# Altium schematic sheet nanopiair_audiohat.SchDoc
size A3
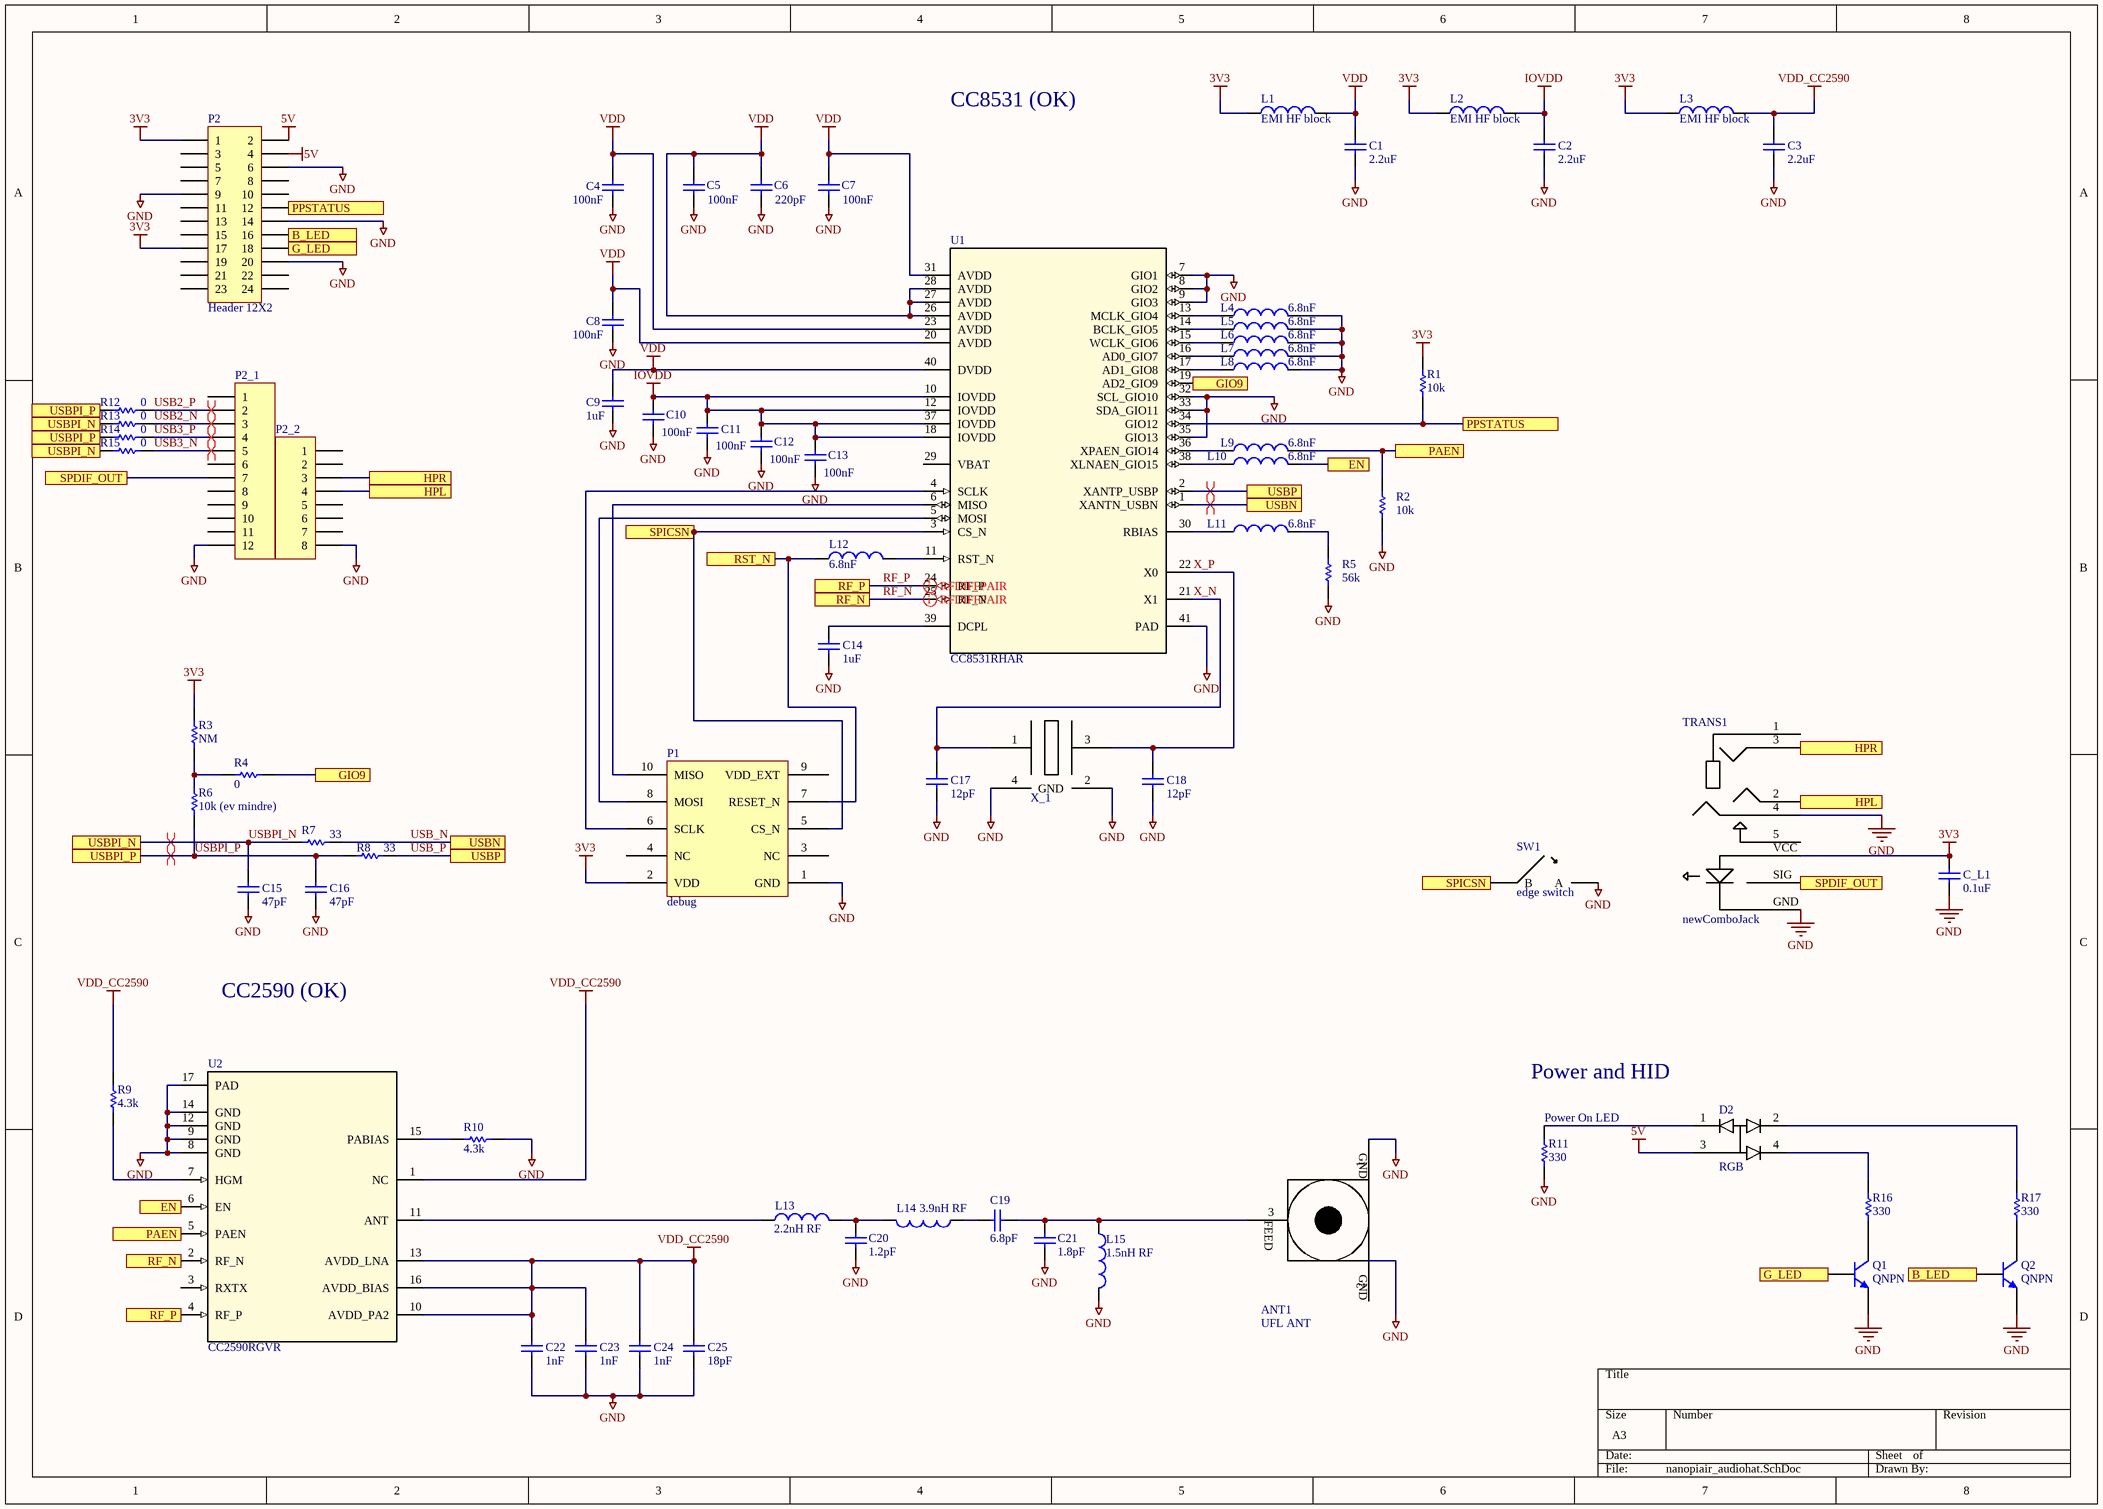
[diagram p0: nanopiair_audiohat.SchDoc]

## Parts
ANT1  UFL ANT  [UFL_ANT]
C1  value 2.2uF  [C_0402]
C2  value 2.2uF  [C_0402]
C3  value 2.2uF  [C_0402]
C4  value 100nF  [C_0402]
C5  value 100nF  [C_0402]
C6  value 220pF  [C_0402]
C7  value 100nF  [C_0402]
C8  value 100nF  [C_0402]
C9  value 1uF  [C_0402]
C10  value 100nF  [C_0402]
C11  value 100nF  [C_0402]
C12  value 100nF  [C_0402]
C13  value 100nF  [C_0402]
C14  value 1uF  [C_0402]
C15  value 47pF  [C_0402]
C16  value 47pF  [C_0402]
C17  value 12pF  [C_0402]
C18  value 12pF  [C_0402]
C19  value 6.8pF  [C_0402_RF_IN]
C20  value 1.2pF  [C_0402_RF_IN_OUT]
C21  value 1.8pF  [C_0402_RF_IN_OUT]
C22  value 1nF  [C_0402]
C23  value 1nF  [C_0402]
C24  value 1nF  [C_0402]
C25  value 18pF  [C_0402]
C_L1  value 0.1uF  [C_0402]
D2  RGB  [RGB]
L1  value EMI HF block  [L_0402]  (hidden comment: Inductor)
L2  value EMI HF block  [L_0402]  (hidden comment: Inductor)
L3  value EMI HF block  [L_0402]  (hidden comment: Inductor)
L4  value 6.8nF  [L_0402]  (hidden comment: Inductor)
L5  value 6.8nF  [L_0402]  (hidden comment: Inductor)
L6  value 6.8nF  [L_0402]  (hidden comment: Inductor)
L7  value 6.8nF  [L_0402]  (hidden comment: Inductor)
L8  value 6.8nF  [L_0402]  (hidden comment: Inductor)
L9  value 6.8nF  [L_0402]  (hidden comment: Inductor)
L10  value 6.8nF  [L_0402]  (hidden comment: Inductor)
L11  value 6.8nF  [L_0402]  (hidden comment: Inductor)
L12  value 6.8nF  [L_0402]  (hidden comment: Inductor)
L13  value 2.2nH RF  [L_0402_RF_IN]  (hidden comment: Inductor)
L14  value 3.9nH RF  [L_0402_RF_IN]  (hidden comment: Inductor)
L15  value 1.5nH RF  [L_0402_RF_IN_OUT]  (hidden comment: Inductor)
P1  debug  [2x5 1.27mm header]
P2  Header 12X2  [HDR2X12]
P2_1  (no value)  [HDR1X12]
P2_2  Header 8  [HDR1X8]  (value not drawn)
Q1  QNPN  [SOT-23B_N]
Q2  QNPN  [SOT-23B_N]
R1  value 10k  [R_0402]  (hidden comment: Res1)
R2  value 10k  [R_0402]  (hidden comment: Res1)
R3  value NM  [R_0402]  (hidden comment: Res1)
R4  value 0  [R_0402]  (hidden comment: Res1)
R5  value 56k  [R_0402]  (hidden comment: Res1)
R6  value 10k (ev mindre)  [R_0402]  (hidden comment: Res1)
R7  value 33  [R_0402]  (hidden comment: Res1)
R8  value 33  [R_0402]  (hidden comment: Res1)
R9  value 4.3k  [R_0402]  (hidden comment: Res1)
R10  value 4.3k  [R_0402]  (hidden comment: Res1)
R11  value 330  [R_0402]  (hidden comment: Res1)
R12  value 0  [R_0402]  (hidden comment: Res1)
R13  value 0  [R_0402]  (hidden comment: Res1)
R14  value 0  [R_0402]  (hidden comment: Res1)
R15  value 0  [R_0402]  (hidden comment: Res1)
R16  value 330  [R_0402]  (hidden comment: Res1)
R17  value 330  [R_0402]  (hidden comment: Res1)
SW1  edge switch  [edge swich]
TRANS1  newComboJack  [audio combojack]
U1  CC8531RHAR  [RHA0040H]
U2  CC2590RGVR  [RGV0016A]
X_1  X_48  [48Mhz 2x1.6mm SMD]  (value not drawn)

## Ports
B_LED, EN, G_LED, GIO9, HPL, HPR, PAEN, PPSTATUS, RF_N, RF_P, RST_N, SPDIF_OUT, SPICSN, USBN, USBP, USBPI_N, USBPI_P

## Nets
3V3: C_L1.2 L1.1 L2.1 L3.1 P1.2(VDD) P2.1 P2.17 R1.2 R3.2 TRANS1.VCC
5V: D2.3(ANODE) P2.2 P2.4
GND: ANT1.1(GND) ANT1.2(GND) C1.1 C2.1 C3.1 C4.1 C5.1 C6.1 C7.1 C8.1 C9.1 C10.2 C11.1 C12.1 C13.1 C14.1 C15.1 C16.1 C17.1 C18.1 C20.2 C21.2 C22.1 C23.1 C24.1 C25.1 C_L1.1 L4.2 L5.2 L6.2 L7.2 L8.2 L15.2 P1.1(GND) P2.6 P2.9 P2.14 P2.20 P2_1.12 P2_2.8 Q1.2(E) Q2.2(E) R2.1 R5.1 R10.1 R11.2 SW1.A TRANS1.4 TRANS1.GND U1.7(GIO1) U1.8(GIO2) U1.9(GIO3) U1.32(SCL_GIO10) U1.33(SDA_GIO11) U1.35(GIO13) U1.41(PAD) U2.8(GND) U2.9(GND) U2.12(GND) U2.14(GND) U2.17(PAD) X_1.2(GND) X_1.4(GND)
IOVDD: C2.2 C10.1 C11.2 C12.2 C13.2 L2.2 U1.10(IOVDD) U1.12(IOVDD) U1.18(IOVDD) U1.37(IOVDD)
VDD: C1.2 C4.2 C5.2 C6.2 C7.2 C8.2 C9.2 L1.2 U1.20(AVDD) U1.23(AVDD) U1.26(AVDD) U1.27(AVDD) U1.28(AVDD) U1.31(AVDD) U1.40(DVDD)
VDD_CC2590: C3.2 C22.2 C23.2 C24.2 C25.2 L3.2 R9.2 U2.1(NC) U2.10(AVDD_PA2) U2.13(AVDD_LNA) U2.16(AVDD_BIAS)
B_LED: P2.16 Q2.1(B) ; port B_LED
EN: L10.2 U2.6(EN) ; port EN
G_LED: P2.18 Q1.1(B) ; port G_LED
GIO9: R4.1 U1.19(AD2_GIO9) ; port GIO9
HPL: P2_2.4 TRANS1.2 ; port HPL
HPR: P2_2.3 TRANS1.3 ; port HPR
PAEN: L9.2 R2.2 U2.5(PAEN) ; port PAEN
PPSTATUS: P2.12 R1.1 U1.34(GIO12) ; port PPSTATUS
RF_N: U1.25(RF_N) U2.2(RF_N) ; port RF_N
RF_P: U1.24(RF_P) U2.4(RF_P) ; port RF_P
RST_N: L12.1 P1.7(RESET_N) ; port RST_N
SPDIF_OUT: P2_1.7 TRANS1.SIG ; port SPDIF_OUT
SPICSN: P1.5(CS_N) SW1.B U1.3(CS_N) ; port SPICSN
USB2_N: P2_1.3 R13.1
USB2_P: P2_1.2 R12.1
USB3_N: P2_1.5 R15.1
USB3_P: P2_1.4 R14.1
USB_N: R7.1 U1.1(XANTN_USBN) ; port USBN
USB_P: R8.1 U1.2(XANTP_USBP) ; port USBP
USBPI_N: C15.2 R7.2 R13.2 R15.2 ; port USBPI_N
USBPI_P: C16.2 R6.1 R8.2 R12.2 R14.2 ; port USBPI_P
X_N: C17.2 U1.21(X1) X_1.1
X_P: C18.2 U1.22(X0) X_1.3
NetANT1_3: ANT1.3(FEED) C19.1 C21.1 L15.1
NetC14_2: C14.2 U1.39(DCPL)
NetC19_2: C19.2 L14.1
NetC20_1: C20.1 L13.2 L14.2
NetD2_1: D2.1(RED) R11.1
NetD2_2: D2.2(GREEN) R17.1
NetD2_4: D2.4(BLUE) R16.1
NetL4_1: L4.1 U1.13(MCLK_GIO4)
NetL5_1: L5.1 U1.14(BCLK_GIO5)
NetL6_1: L6.1 U1.15(WCLK_GIO6)
NetL7_1: L7.1 U1.16(AD0_GIO7)
NetL8_1: L8.1 U1.17(AD1_GIO8)
NetL9_1: L9.1 U1.36(XPAEN_GIO14)
NetL10_1: L10.1 U1.38(XLNAEN_GIO15)
NetL11_1: L11.1 U1.30(RBIAS)
NetL11_2: L11.2 R5.2
NetL12_2: L12.2 U1.11(RST_N)
NetL13_1: L13.1 U2.11(ANT)
NetP1_6: P1.6(SCLK) U1.4(SCLK)
NetP1_8: P1.8(MOSI) U1.5(MOSI)
NetP1_10: P1.10(MISO) U1.6(MISO)
NetQ1_3: Q1.3(C) R16.2
NetQ2_3: Q2.3(C) R17.2
NetR3_1: R3.1 R4.2 R6.2
NetR9_1: R9.1 U2.7(HGM)
NetR10_2: R10.2 U2.15(PABIAS)

Not connected (* = marked no-connect by the designer): P1 3(NC) 4(NC) 9(VDD_EXT); P2 3 5 7 8 10 11 13 15 19 21 22 23 24; P2_1 1 6 8 9 10 11; P2_2 1 2 5 6 7; TRANS1 1 5; U1 29(VBAT); U2 3(RXTX)

## Layout directives
differential pair: RF_N, RF_P, USB2_N, USB2_P, USB3_N, USB3_P, USB_N, USB_P, USBPI_N, USBPI_P

## Notes on the sheet
- CC8531 (OK)
- CC2590 (OK)
- Power and HID
- (near R11) Power On LED

## Library data of the parts
C1-C25 C_L1 = Cap
P2 = Header 12X2: Header, 12-Pin, Dual row; LatestRevisionDate: 17-Jul-2002; LatestRevisionNote: Re-released for DXP Platform.; Publisher: Altium Limited
P2_1 = Header 12: Header, 12-Pin; LatestRevisionDate: 17-Jul-2002; LatestRevisionNote: Re-released for DXP Platform.; Publisher: Altium Limited
P2_2 = Header 8: Header, 8-Pin; LatestRevisionDate: 17-Jul-2002; LatestRevisionNote: Re-released for DXP Platform.; Publisher: Altium Limited
Q1 Q2 = QNPN: NPN Bipolar Transistor; Published: 8-Jun-2000; LatestRevisionDate: 29-May-2009; LatestRevisionNote: IPC-7351 Footprint Added.; PackageVersion: Aug-1999; PackageReference: SOT-23B; Publisher: Altium Limited; PackageDescription: 3-Pin SOT-23 Package 0.95 mm Pitch, 2.4 mm Lead Span
R1-R17 = Res1: Resistor
U1 = CC8531RHAR: Imported; Manufacturer: Texas Instruments; PartNumber: CC8531RHAR; RefDes: RefDes; TYPE: TYPE; Value: Value
U2 = CC2590RGVR: Imported; Manufacturer: Texas Instruments; PartNumber: CC2590RGVR; RefDes: RefDes; TYPE: TYPE; Value: Value